# Altium schematic sheet Logic_controller.SchDoc
size A3; SheetNumber: 2; SheetTotal: 6
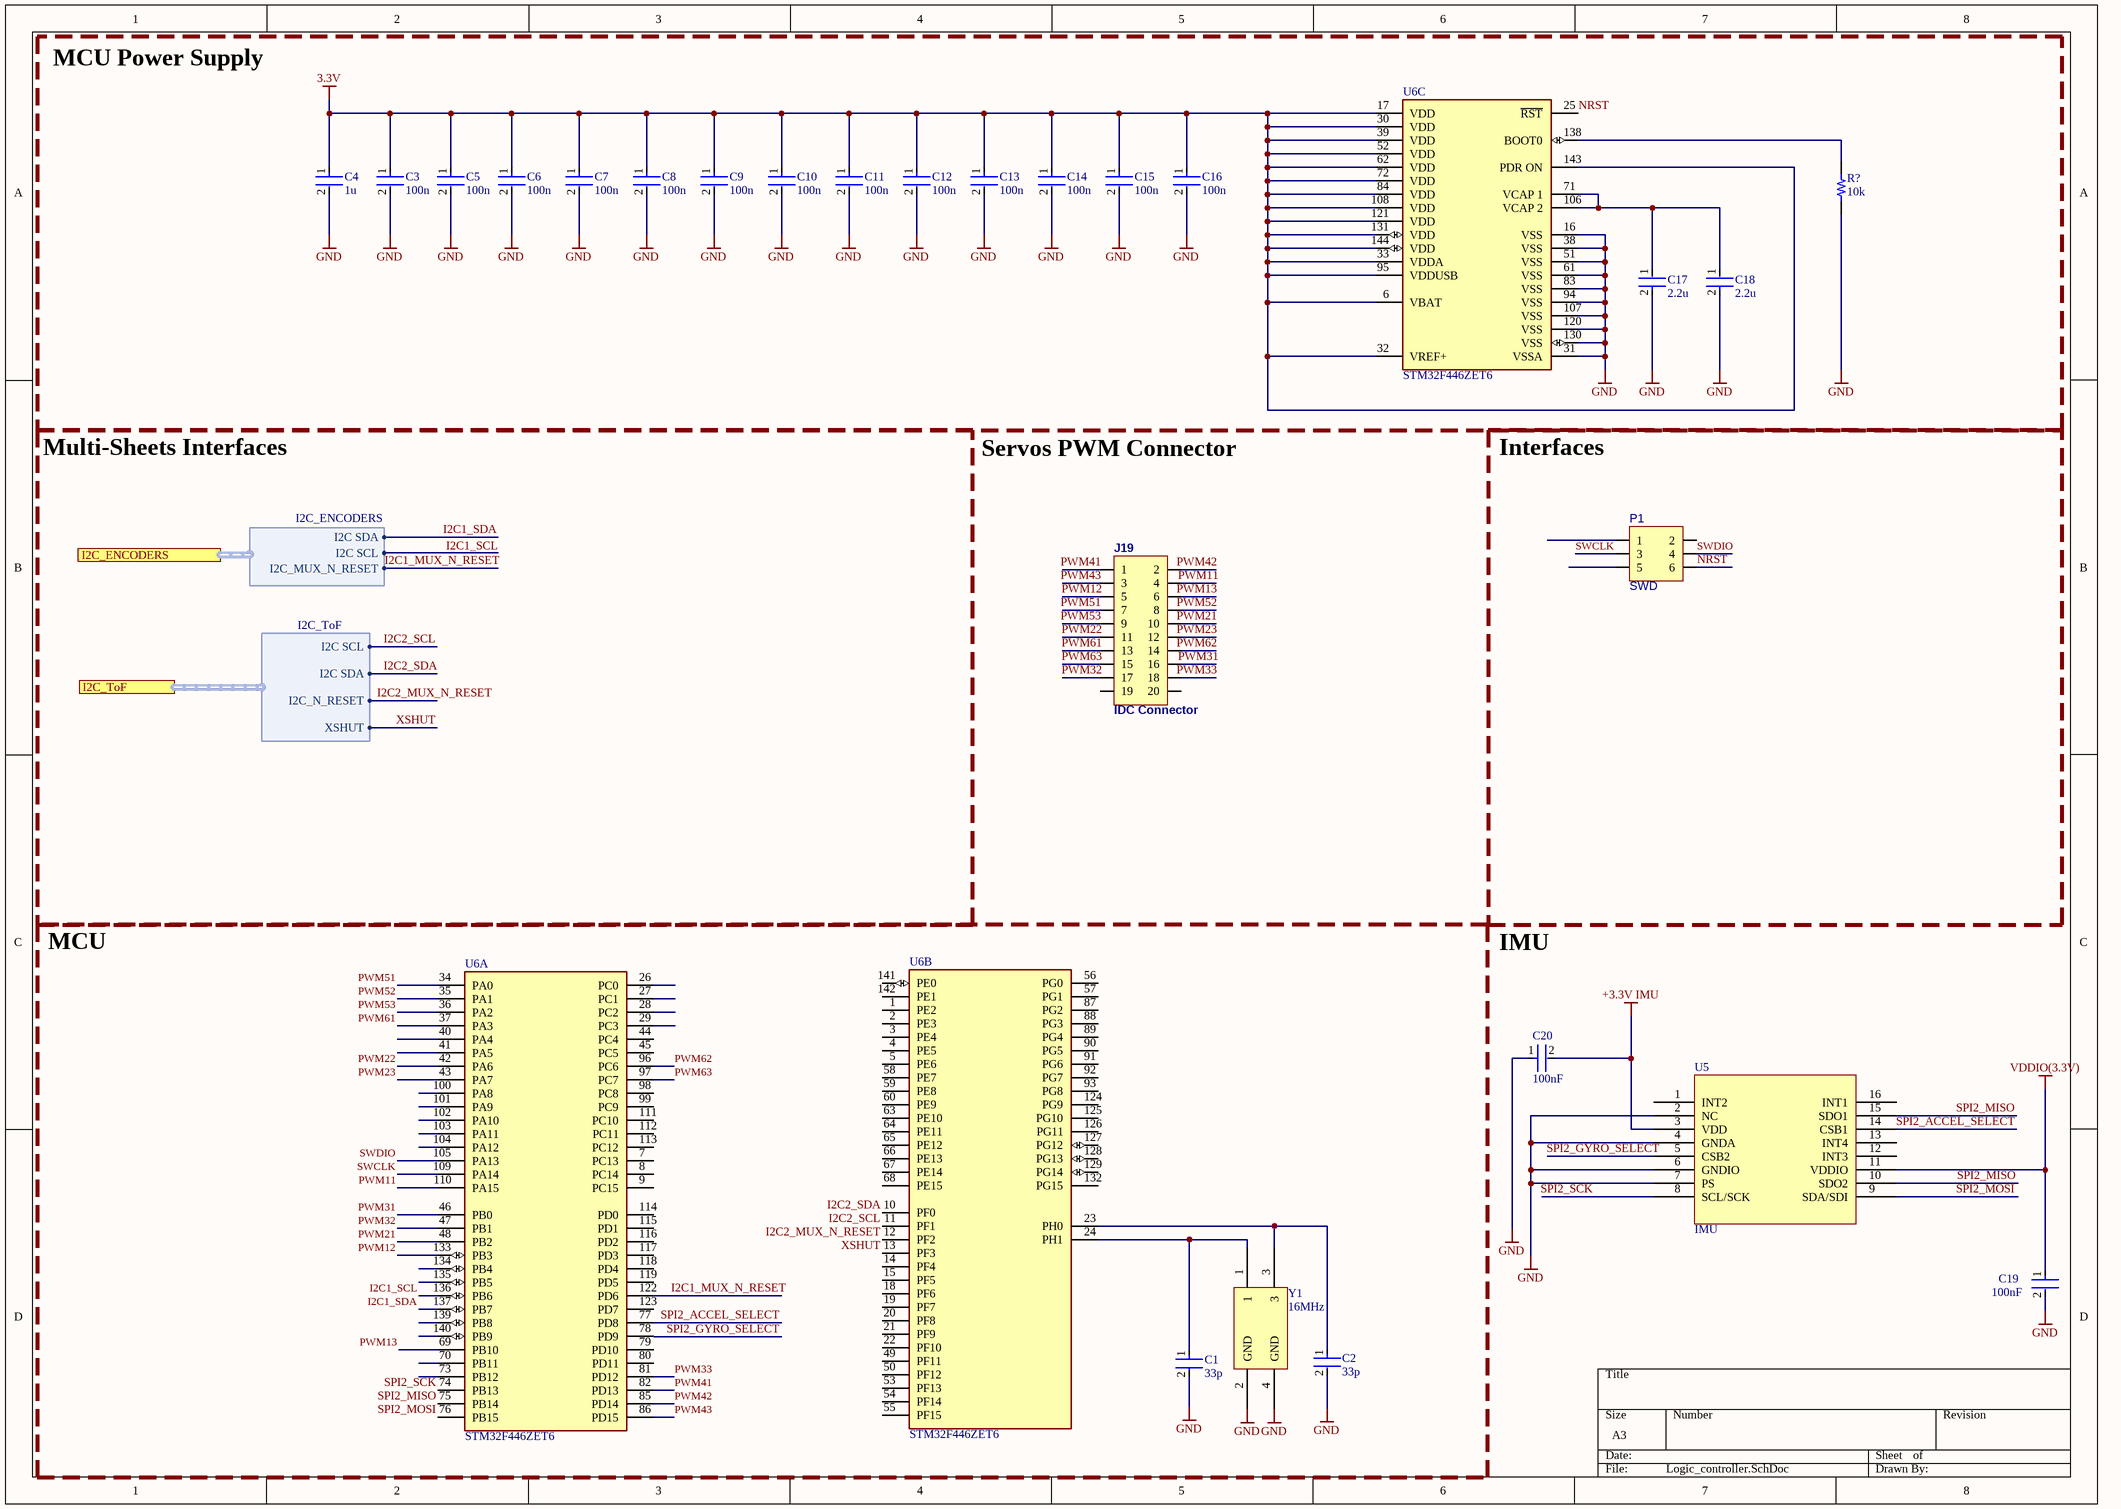
[diagram p0: Logic_controller.SchDoc]

## Parts
C1  33p  [FP-C0603C-CF-MFG]
C2  33p  [FP-C0603C-CF-MFG]
C3  100n  [FP-C0603C-CF-MFG]
C4  1u  [FP-C0603C-CF-MFG]
C5  100n  [FP-C0603C-CF-MFG]
C6  100n  [FP-C0603C-CF-MFG]
C7  100n  [FP-C0603C-CF-MFG]
C8  100n  [FP-C0603C-CF-MFG]
C9  100n  [FP-C0603C-CF-MFG]
C10  100n  [FP-C0603C-CF-MFG]
C11  100n  [FP-C0603C-CF-MFG]
C12  100n  [FP-C0603C-CF-MFG]
C13  100n  [FP-C0603C-CF-MFG]
C14  100n  [FP-C0603C-CF-MFG]
C15  100n  [FP-C0603C-CF-MFG]
C16  100n  [FP-C0603C-CF-MFG]
C17  2.2u  [FP-C1608-080-0_1-MFG]
C18  2.2u  [FP-C1608-080-0_1-MFG]
C19  100nF  [FP-CC0603-DA-MFG]
C20  100nF  [FP-CC0603-DA-MFG]
J19  IDC Connector  [IDC20]
P1  SWD  [GP_3x2]
R?  10k  [RES 0603_1608]
U5  IMU  [BMI088-Footprint-1]
U6  STM32F446ZET6  [FP-STM32F446ZET6-IPC_C]  (parts A,B,C of 3)
Y1  16MHz  [New footprint 1]

## Blocks framed on the sheet
MCU Power Supply: C3-C18 R? U6
Interfaces: P1
MCU: C1 C2 U6 Y1

## Ports
I2C_ENCODERS (harness I2C_ENCODERS, see Schield_elkapod[2B], Connection_of_encoders[1A]), I2C_ToF (harness I2C_ToF, see Schield_elkapod[2A], ToF_sensors[1A])

## Harnesses
I2C_ENCODERS: I2C SDA, I2C SCL, I2C_MUX_N_RESET
I2C_ToF: I2C SCL, I2C SDA, I2C_N_RESET, XSHUT

## Nets
3.3V: C3.1 C4.1 C5.1 C6.1 C7.1 C8.1 C9.1 C10.1 C11.1 C12.1 C13.1 C14.1 C15.1 C16.1 U6.6(VBAT) U6.17(VDD) U6.30(VDD) U6.32(VREF+) U6.33(VDDA) U6.39(VDD) U6.52(VDD) U6.62(VDD) U6.72(VDD) U6.84(VDD) U6.95(VDDUSB) U6.108(VDD) U6.121(VDD) U6.131(VDD) U6.143(PDR_ON) U6.144(VDD)
+3.3V IMU: C20.2 U5.3(VDD)
GND: C1.2 C2.2 C3.2 C4.2 C5.2 C6.2 C7.2 C8.2 C9.2 C10.2 C11.2 C12.2 C13.2 C14.2 C15.2 C16.2 C17.2 C18.2 C19.2 C20.1 R?.2 U5.2(NC) U5.4(GNDA) U5.6(GNDIO) U5.7(PS) U6.16(VSS) U6.31(VSSA) U6.38(VSS) U6.51(VSS) U6.61(VSS) U6.83(VSS) U6.94(VSS) U6.107(VSS) U6.120(VSS) U6.130(VSS) Y1.2(GND) Y1.4(GND)
VDDIO(3.3V): C19.1 U5.11(VDDIO)
I2C1_MUX_N_RESET: U6.122(PD6) ; port I2C_ENCODERS.I2C_MUX_N_RESET
I2C1_SCL: U6.136(PB6) ; port I2C_ENCODERS.I2C SCL
I2C1_SDA: U6.137(PB7) ; port I2C_ENCODERS.I2C SDA
I2C2_MUX_N_RESET: U6.12(PF2) ; port I2C_ToF.I2C_N_RESET
I2C2_SCL: U6.11(PF1) ; port I2C_ToF.I2C SCL
I2C2_SDA: U6.10(PF0) ; port I2C_ToF.I2C SDA
NRST: P1.6 U6.25(~{RST})
PWM11: J19.4 U6.110(PA15)
PWM12: J19.5 U6.133(PB3)
PWM13: J19.6 U6.69(PB10)
PWM21: J19.10 U6.48(PB2)
PWM22: J19.11 U6.42(PA6)
PWM23: J19.12 U6.43(PA7)
PWM31: J19.16 U6.46(PB0)
PWM32: J19.17 U6.47(PB1)
PWM33: J19.18 U6.81(PD12)
PWM41: J19.1 U6.82(PD13)
PWM42: J19.2 U6.85(PD14)
PWM43: J19.3 U6.86(PD15)
PWM51: J19.7 U6.34(PA0)
PWM52: J19.8 U6.35(PA1)
PWM53: J19.9 U6.36(PA2)
PWM61: J19.13 U6.37(PA3)
PWM62: J19.14 U6.96(PC6)
PWM63: J19.15 U6.97(PC7)
SPI2_ACCEL_SELECT: U5.14(CSB1) U6.77(PD8)
SPI2_GYRO_SELECT: U5.5(CSB2) U6.78(PD9)
SPI2_MISO: U5.10(SDO2) U5.15(SDO1) U6.75(PB14)
SPI2_MOSI: U5.9(SDA/SDI) U6.76(PB15)
SPI2_SCK: U5.8(SCL/SCK) U6.74(PB13)
SWCLK: P1.3 U6.109(PA14)
SWDIO: P1.4 U6.105(PA13)
XSHUT: U6.13(PF3) ; port I2C_ToF.XSHUT
NetC1_1: C1.1 U6.24(PH1) Y1.1
NetC2_1: C2.1 U6.23(PH0) Y1.3
NetC17_1: C17.1 C18.1 U6.71(VCAP_1) U6.106(VCAP_2)
NetR?_1: R?.1 U6.138(BOOT0)

Not connected (* = marked no-connect by the designer): J19 19 20; P1 1 2 5; U5 1(INT2) 12(INT3) 13(INT4) 16(INT1); U6 1(PE2) 2(PE3) 3(PE4) 4(PE5) 5(PE6) 7(PC13) 8(PC14) 9(PC15) 14(PF4) 15(PF5) 18(PF6) 19(PF7) 20(PF8) 21(PF9) 22(PF10) 26(PC0) 27(PC1) 28(PC2) 29(PC3) 40(PA4) 41(PA5) 44(PC4) 45(PC5) 49(PF11) 50(PF12) 53(PF13) 54(PF14) 55(PF15) 56(PG0) 57(PG1) 58(PE7) 59(PE8) 60(PE9) 63(PE10) 64(PE11) 65(PE12) 66(PE13) 67(PE14) 68(PE15) 70(PB11) 73(PB12) 79(PD10) 80(PD11) 87(PG2) 88(PG3) 89(PG4) 90(PG5) 91(PG6) 92(PG7) 93(PG8) 98(PC8) 99(PC9) 100(PA8) 101(PA9) 102(PA10) 103(PA11) 104(PA12) 111(PC10) 112(PC11) 113(PC12) 114(PD0) 115(PD1) 116(PD2) 117(PD3) 118(PD4) 119(PD5) 123(PD7) 124(PG9) 125(PG10) 126(PG11) 127(PG12) 128(PG13) 129(PG14) 132(PG15) 134(PB4) 135(PB5) 139(PB8) 140(PB9) 141(PE0) 142(PE1)

## Notes on the sheet
- Multi-Sheets Interfaces
- Servos PWM Connector
- IMU

## Library data of the parts
C1 C2 = CMP-03020-030291-1: Cap Ceramic 0.0027uF 25V C0G 1% SMD 0603 125°C Paper T/R; Manufacturer: KEMET; Manufacturer Part Number: C0603C272F3GAC7867; Automotive Grade: Grade 1; Tolerance: 0.01; Value: 2,700 pF; Temperature Coefficient: 30ppm/°C; Material: Ceramic; Device Class L2: Capacitors; Device Class L3: Ceramic Capacitors; ComponentLink2Description: Datasheet; Category: Cap; Automotive: Yes; Octopart: https://octopart.com/c0603c272f3gac7867-kemet-90390867; Temperature Range High: +125°C; Package: C0603C-CF; Device Class L1: Passive Components; Digikey Description: Cap Ceramic 0.0027uF 25V C0G 1% SMD 0603 125°C Paper T/R; Temperature Characteristic: C0G; Temperature Range Low: -55°C; Temperature: -55°C to +125°C; Height: 0.87mm; ComponentLink2URL: https://api.kemet.com/component-edge/download/datasheet/C0603C100J5GACAUTO.pdf; Voltage Rating: 25 V; Capacitance: 2,700 pF; Lead Free: Yes; RoHS: TRUE
C3 C5-C16 = CMP-03020-030291-1: CAP CER 100nF 25V X5R 0603 C0603C272F3GAC7867; Manufacturer: KEMET; Material: Ceramic; Automotive Grade: Grade 1; Tolerance: 0.01; Temperature Characteristic: C0G; Value: 2,700 pF; Temperature Coefficient: 30ppm/°C; Device Class L2: Capacitors; Device Class L3: Ceramic Capacitors; ComponentLink2Description: Datasheet; Category: Cap; Automotive: Yes; Octopart: https://octopart.com/c0603c272f3gac7867-kemet-90390867; Temperature Range High: +125°C; Package: C0603C-CF; Device Class L1: Passive Components; Digikey Description: Cap Ceramic 0.0027uF 25V C0G 1% SMD 0603 125°C Paper T/R; Temperature Range Low: -55°C; Temperature: -55°C to +125°C; Height: 0.87mm; ComponentLink2URL: https://api.kemet.com/component-edge/download/datasheet/C0603C100J5GACAUTO.pdf; Voltage Rating: 25 V; Capacitance: 2,700 pF; Lead Free: Yes; Manufacturer Part Number: C0603C272F3GAC7867; RoHS: TRUE
C4 = CMP-03020-030291-1: CAP CER 1uF 16V X5R 0603 C0603C272F3GAC7867; Manufacturer: KEMET; Material: Ceramic; Automotive Grade: Grade 1; Tolerance: 0.01; Temperature Characteristic: C0G; Value: 2,700 pF; Voltage Rating: 25 V; Temperature Coefficient: 30ppm/°C; Device Class L2: Capacitors; Device Class L3: Ceramic Capacitors; ComponentLink2Description: Datasheet; Category: Cap; Automotive: Yes; Octopart: https://octopart.com/c0603c272f3gac7867-kemet-90390867; Temperature Range High: +125°C; Package: C0603C-CF; Device Class L1: Passive Components; Digikey Description: Cap Ceramic 0.0027uF 25V C0G 1% SMD 0603 125°C Paper T/R; Temperature Range Low: -55°C; Temperature: -55°C to +125°C; Height: 0.87mm; ComponentLink2URL: https://api.kemet.com/component-edge/download/datasheet/C0603C100J5GACAUTO.pdf; Capacitance: 2,700 pF; Lead Free: Yes; Manufacturer Part Number: C0603C272F3GAC7867; RoHS: TRUE
C17 C18 = CMP-08246-003049-1: Multilayer Ceramic Capacitors 2.2μF ±10% 25V X5R SMD 0603 C1608X5R1E225K080AB; Capacitance: 2.2uF; Termination: SMD/SMT; Dielectric Material: Ceramic; REACH SVHC: No SVHC; Voltage Rating (DC): 25V; Voltage Rating: 25V; RoHS Compliant: Yes; Case Code (Imperial): 0603; Case/Package: 0603; Height: 0.8mm; Mount: Surface Mount; Min Operating Temperature: -55°C; Tolerance: 10%; Radiation Hardening: No; Dielectric: X5R; Depth: 0.8mm; Package Quantity: 4000; Length: 1.6mm; Weight: 7.1E-05oz; Resistor Type: Ceramic; Series: C; Thickness: 0.035inch; Width: 0.031inch; Case Code (Metric): 1608; Lead Free: Lead Free; Max Operating Temperature: 85°C; Packaging: Tape and Reel
C19 C20 = CMP-2100-03601-2: CAP CER 0.1UF 50V X7R 0603 CC0603KRX7R9BB104; Manufacturer: YAGEO; Material: Ceramic; Temperature Coefficient: 15%; Tolerance: 0.1; Height: 0.9mm; Voltage: 50 V; ComponentLink2Description: Datasheet; Device Class L2: Capacitors; Temperature Range High: +125°C; Category: Cap; Capacitance: 100 nF; Footprint Url: http://www.yageo.com/exep/pages/download/literatures/UPY-C_GEN_24.pdf; ComponentLink2URL: http://www.yageo.com/documents/recent/UPY-GPHC_X7R_6.3V-to-50V_18.pdf; Package: CC0603-DA; Temperature: -55°C to +125°C; Voltage Rating: 50 V; Temperature Characteristic: X7R; Device Class L1: Passive Components; Temperature Range Low: -55°C; Manufacturer Part Number: CC0603KRX7R9BB104; RoHS: TRUE; Automotive: No; Value: 100 nF; Device Class L3: Ceramic Capacitors; Octopart: https://octopart.com/cc0603krx7r9bb104-yageo-42244635; Mouser Description: Multilayer Ceramic Capacitor, CC Series, 0.1 - F, - 10%, X7R, 50 V, 0603 [1608 Metric]; Lead Free: Yes; Digikey Description: CAP CER 0.1UF 50V X7R 0603
J19 = CN_10x2
P1 = CN_3x2
R? = RNCS0603BKE10K0: RES 10K OHM 1% 0,1W 0603; Manufacturer: Stackpole Electronics Inc; Power (Watts): 0.063W, 1/16W; Temperature Coefficient: ±25ppm/°C; Tolerance: ±0.1%; Part Number: RNCS0603BKE10K0; Value: 10k; Composition: Thin Film; Device Package: 0603 (1608 Metric); Features: Anti-Corrosive, Automotive AEC-Q200, Moisture Resistant; Height - Seated (Max): 0.022" (0.55mm); LastUpdated: 09.02.2024 20:43:37; Lifecycle Status: Active; Minimum Order: 1; Number of Terminations: 2; Operating Temperature: -55°C ~ 155°C; Package / Case: 0603 (1608 Metric); Packaging: TapeAndReel; PartId: 4838; Part Status: Active; Price: 0.06; Ratings: AEC-Q200; Resistance: 10k; Series: RNCS; Size / Dimension: 0.061" L x 0.031" W (1.55mm x 0.80mm); Supplier Device Package: 0603
U5 = CMP-00030-00005-6: BMI088 Series 3.6 V 6 Axis Digital Output Accelerometer Motion Sensor - LGA-16
U6 = CMP-12105-000067-1: IC MCU 32BIT 512KB FLASH 144LQFP; Manufacturer: STMicroelectronics; Standoff Height: 0.05mm; Memory Size: 512KBytes; Data Bus Width: 32bits; Number Of Timers/Counters: 14; Number Of I2C Channels: 4; Number Of Usb Channels: 2; Frequency: 180MHz; Ram Size: 128KBytes; Number Of I/Os: 114; Min Supply Voltage: 1.7V; Max Junction Temp: +105°C; Number Of Cores: 1; Core Architecture: Arm Cortex-M4; Max Supply Voltage: 3.6V; Number Of Adc Channels: 24; Number Of Pwm Channels: 32; Number Of Uart Channels: 6; Number Of A/D Converters: 3; Interface: I2C,SPI,UART,USART,EBI/EMI,CAN,USB,LIN,IrDA,I2S,SMBus,Other; Mouser Description: 32 Bit Microcontroller, High Performance, Arm Cortex-M4, 180 Mhz, 512 Kb, 128 Kb, 144, Lqfp; Temperature Range High: +105°C; Device Class L3: Microcontrollers; Ambient Temperature Range High: +85°C; Lead Free: Yes; Octopart: https://octopart.com/stm32f446zet6-stmicroelectronics-52642927; Device Class L2: Embedded Processors and Controllers; Height: 1.6mm; Category: IC; Manufacturer Part Number: STM32F446ZET6; RoHS: TRUE; Memory Type: FLASH; Temperature: -40°C to +105°C; Number Of Spi Channels: 4; Device Class L1: Integrated Circuits (ICs); Package: LQFP144; Digikey Description: IC MCU 32BIT 512KB FLASH 144LQFP; Automotive: No; ComponentLink2Description: Datasheet; ComponentLink2URL: https://www.st.com/content/ccc/resource/technical/document/datasheet/65/cb/75/50/53/d6/48/24/DM00141306.pdf/files/DM00141306.pdf/jcr:content/translations/en.DM00141306.pdf; Ambient Temperature Range Low: -40°C; Temperature Range Low: -40°C
Y1 = CMP-00030-00007-3: resonator 16MHz LFXTAL030819BULK